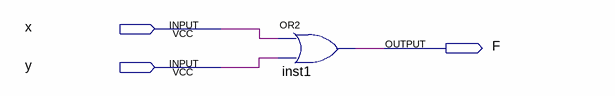
[diagram p0: schematic sheet]
// Quartus schematic Exercise1Question3Simplified.bdf as structural Verilog: 1 symbols, 3 pins
module Exercise1Question3Simplified (
  input  x,
  input  y,
  output F
);

  or inst1 (F, x, y);
endmodule
